# EAGLE design working (EAGLE 9.6.2)
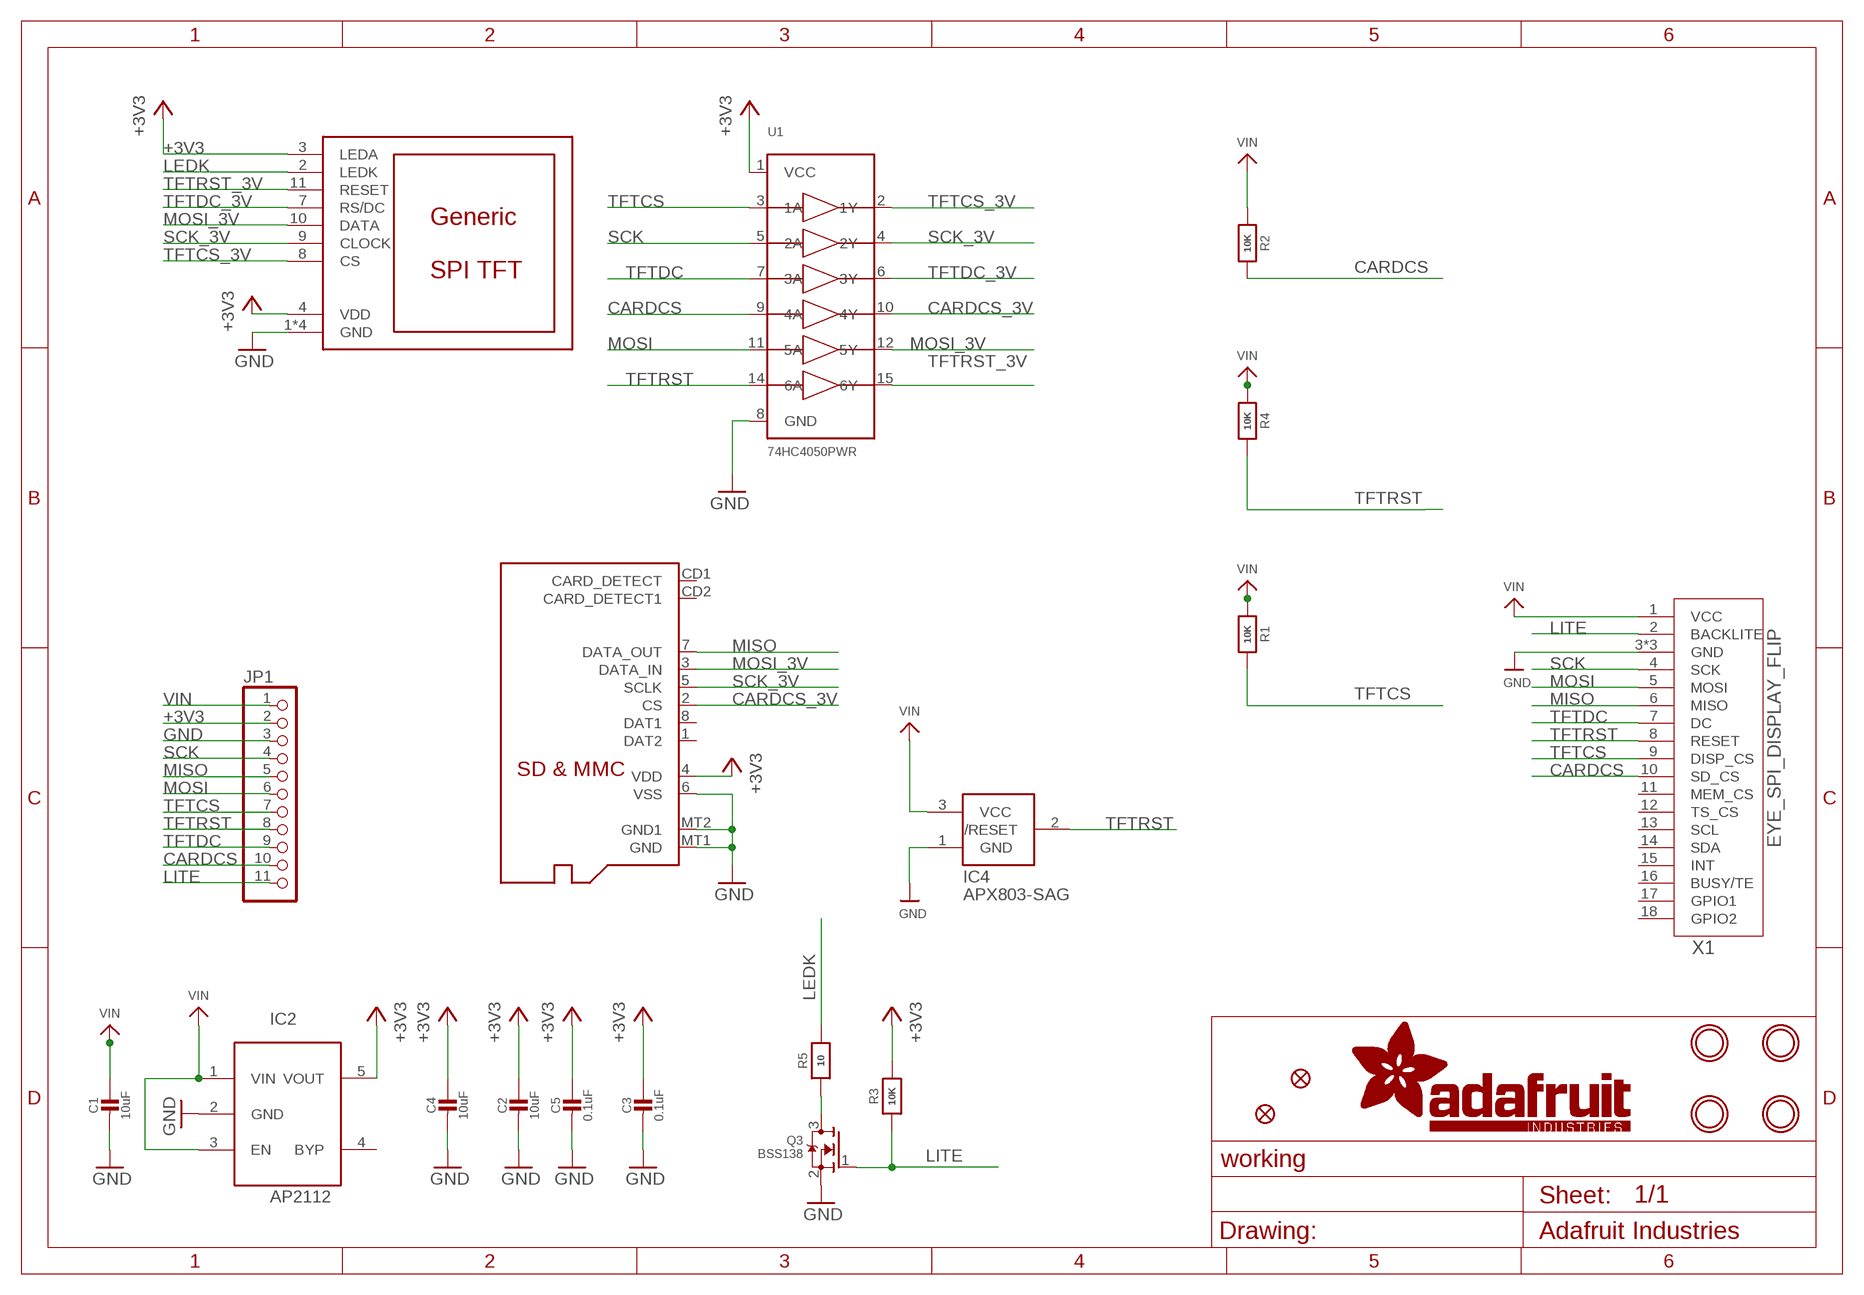
[diagram p0: schematic, sheet 1]

## Parts
C1  10uF  CAP_CERAMIC0805-NOOUTLINE  [0805-NO]
C2  10uF  CAP_CERAMIC0805-NOOUTLINE  [0805-NO]
C3  0.1uF  CAP_CERAMIC0603_NO  [0603-NO]
C4  10uF  CAP_CERAMIC0805-NOOUTLINE  [0805-NO]
C5  0.1uF  CAP_CERAMIC0603_NO  [0603-NO]
DISP1  DISP_LCD_GENERIC_SPI_1.47IN_172X320_12P_WRAPUNDER  [TFT_1.47IN_172X320_12P]
IC2  AP2112  LP298XS  [SOT23-5L]
IC4  APX803-SAG  AXP083-SAG  [SOT23]
JP1  HEADER-1X1176MIL  [1X11_ROUND_76]
Q2  MICROSD  [MICROSD]
Q3  BSS138  MOSFET-NWIDE  [SOT23-WIDE]
R1  10K  RESISTOR_0603_NOOUT  [0603-NO]
R2  10K  RESISTOR_0603_NOOUT  [0603-NO]
R3  10K  RESISTOR_0603_NOOUT  [0603-NO]
R4  10K  RESISTOR_0603_NOOUT  [0603-NO]
R5  10  RESISTOR_0603_NOOUT  [0603-NO]
U1  74HC4050PWR  74HC4050DTSSOP  [TSSOP16]
U$4  FIDUCIAL_1MM  [FIDUCIAL_1MM]
U$5  FIDUCIAL_1MM  [FIDUCIAL_1MM]
U$7  MOUNTINGHOLE2.5  [MOUNTINGHOLE_2.5_PLATED]
U$8  MOUNTINGHOLE2.5  [MOUNTINGHOLE_2.5_PLATED]
U$9  MOUNTINGHOLE2.5  [MOUNTINGHOLE_2.5_PLATED]
U$10  MOUNTINGHOLE2.5  [MOUNTINGHOLE_2.5_PLATED]
X1  EYE_SPI_DISPLAY_FLIP  [EYE_SPI_DISPLAY_BOTCONTACT]

## Nets
+3V3 [power]: C2.1 C3.1 C4.1 C5.1 DISP1.3(LEDA) DISP1.4(VDD) IC2.5(VOUT) JP1.2 Q2.4(VDD) R3.2 U1.1(VCC)
CARDCS: JP1.10 R2.1 U1.9(4A) X1.10(SD_CS)
CARDCS_3V: Q2.2(CS) U1.10(4Y)
GND: C1.2 C2.2 C3.2 C4.2 C5.2 DISP1.1(GND) DISP1.5(GND) DISP1.6(GND) DISP1.12(GND) IC2.2(GND) IC4.1(GND) JP1.3 Q2.6(VSS) Q2.MT1(GND) Q2.MT2(GND1) Q3.2(S) U1.8(GND) X1.3(GND) X1.SUPPORT1(GND) X1.SUPPORT2(GND)
LEDK: DISP1.2(LEDK) R5.2
LITE: JP1.11 Q3.1(G) R3.1 X1.2(BACKLITE)
MISO: JP1.5 Q2.7(DATA_OUT) X1.6(MISO)
MOSI: JP1.6 U1.11(5A) X1.5(MOSI)
MOSI_3V: DISP1.10(DATA) Q2.3(DATA_IN) U1.12(5Y)
N$1: Q3.3(D) R5.1
SCK: JP1.4 U1.5(2A) X1.4(SCK)
SCK_3V: DISP1.9(CLOCK) Q2.5(SCLK) U1.4(2Y)
TFTCS: JP1.7 R1.1 U1.3(1A) X1.9(DISP_CS)
TFTCS_3V: DISP1.8(CS) U1.2(1Y)
TFTDC: JP1.9 U1.7(3A) X1.7(DC)
TFTDC_3V: DISP1.7(RS/DC) U1.6(3Y)
TFTRST: IC4.2(/RESET) JP1.8 R4.1 U1.14(6A) X1.8(RESET)
TFTRST_3V: DISP1.11(RESET) U1.15(6Y)
VIN [power]: C1.1 IC2.1(VIN) IC2.3(EN) IC4.3(VCC) JP1.1 R1.2 R2.2 R4.2 X1.1(VCC)
Unconnected: IC2.4(BYP) Q2.1(DAT2) Q2.8(DAT1) Q2.CD1(CARD_DETECT) Q2.CD2(CARD_DETECT1) X1.11(MEM_CS) X1.12(TS_CS) X1.13(SCL) X1.14(SDA) X1.15(INT) X1.16(BUSY/TE) X1.17(GPIO1) X1.18(GPIO2)

## Library data of the parts
C1-C5 = microbuilder:CAP_CERAMIC: Ceramic Capacitors For new designs, use the packages preceded by an '_' character since they are more reliable: The following footprints should be used on most boards: _0402 - Standard footprint for regular board layouts _0603 - Standard footprint for regular board layouts _0805 - Standard footprint for regular board layouts _1206 - Standard footprint for regular board layouts For extremely tight-pitch boards where space is at a premium, the following 'micro-pitch' footprints can be used (smaller pads, no silkscreen outline, etc.): _0402MP - Micro-pitch footprint for very dense/compact boards _0603MP - Micro-pitch footprint for very dense/compact boards _0805MP - Micro-pitch footprint for very dense/compact boards _1206MP - Micro-pitch footprint for very dense/compact boards
DISP1 = adafruit_display:DISP_LCD_GENERIC_SPI
IC2 = adafruit:LP298X
IC4 = adafruit:AXP083
JP1 = microbuilder:HEADER-1X11
Q2 = adafruit:MICROSD: Micro-SD / Transflash card holder with SPI pinout For the 3M # 2908-05WB-MG and/or 4UCON #19656 push-push type
Q3 = microbuilder:MOSFET-N: N-Channel Mosfet LEGEND VDS: Voltage Drain-Source ID: Drain Current RDS(ON): Drain-Source On-State Resistance VGS(TH): Gate-Source Threshold Voltage CISS: Drain-Source Input Capacitance SOT-23 Name VDS ID RDS(ON) VGS(TH) CISS Order Number 2N7002E 60V 260mA 2.5 Ohm 2.5V @ 250uA 26.7pF @ 25V 2N7002ET1GOSTR-ND BSH103 30V 850mA 400 mOhm 400mV @ 1mA 83pF @ 24V BSH103,235-ND BSS138 60V 320mA 1.6 Ohm 1.5V @ 250uA 50pF @ 10V Mouser: 771-BSS138PW115 DMN2075U-7 20V 4.2A 38 mOhm 1V @ 250 uA 594.3pF @ 10V DMN2075U-7DICT-ND * BSS138 good choice for I2C level-shifting POWERPAK 1212-8 Name VDS ID RDS(ON) VGS(TH) CISS Order Number Si7308DN 60V 6A 58 mOhm 3V @ 250uA 665pF @ 15V SI7308DN-T1-E3CT-ND
R1-R5 = microbuilder:RESISTOR: Resistors For new designs, use the packages preceded by an '_' character since they are more reliable: The following footprints should be used on most boards: _0402 - Standard footprint for regular board layouts _0603 - Standard footprint for regular board layouts _0805 - Standard footprint for regular board layouts _1206 - Standard footprint for regular board layouts For extremely tight-pitch boards where space is at a premium, the following 'micro-pitch' footprints can be used (smaller pads, no silkscreen outline, etc.): _0402MP - Micro-pitch footprint for very dense/compact boards _0603MP - Micro-pitch footprint for very dense/compact boards _0805MP - Micro-pitch footprint for very dense/compact boards _1206MP - Micro-pitch footprint for very dense/compact boards
U1 = microbuilder:74HC4050D: 6-channel level shifter 74HC4050D - 2V-6V Supply SOIC16 Digikey: 74HC4050D,653-ND Mouser: 771-74HC4050D-T TSSOP16 Digikey: 296-9215-1-ND Mouser:
U$4 U$5 = microbuilder:FIDUCIAL: Fiducial Alignment Points Various fiducial points for machine vision alignment.; BOM: EXCLUDE
U$7-U$10 = microbuilder:MOUNTINGHOLE: Mounting Hole For #2 screws (0.086"/2.18mm width, 0.094"/2.4mm hole) use 2.5mm; BOM: EXCLUDE
X1 = adafruit_display:EYE_SPI_DISPLAY

## Net classes
1 power: width 0.254 mm

## Board
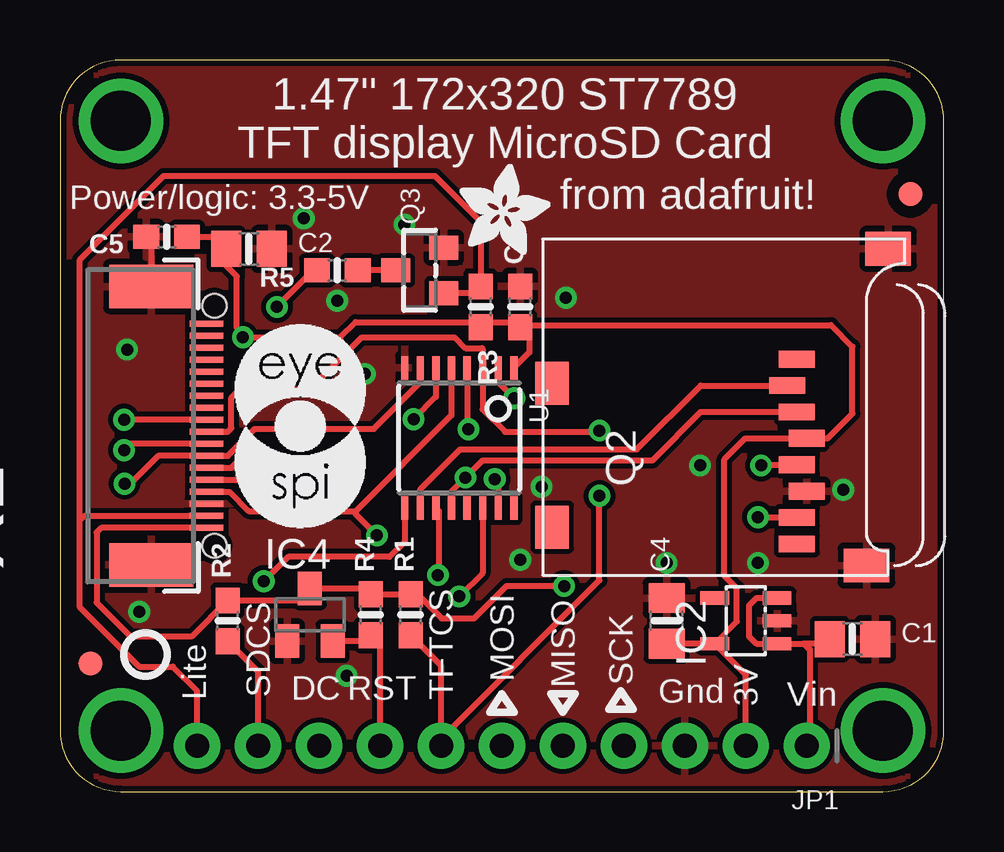
[diagram p1: board, top side]
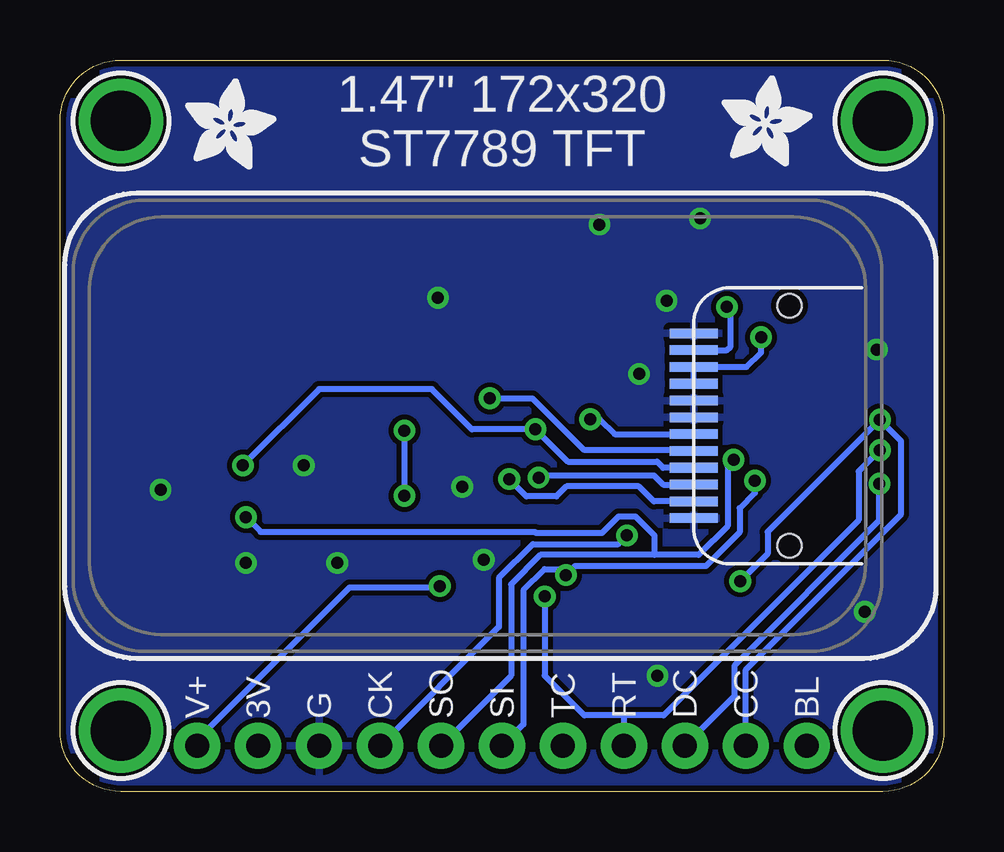
[diagram p2: board, bottom side, seen from below]

Size 36.83 x 30.48 mm. Coordinates in mm from the lower left corner, seen from the top.
Outline: 0,27.94 0,2.54 arc90 2.54,0 34.29,0 arc90 36.83,2.54 36.83,27.94 arc90 34.29,30.48 2.54,30.48 arc90 0,27.94
Copper layers (1*16): Top 0.035mm / dielectric 1.5mm / Bottom 0.035mm
Design rules "adafruit *": minimum track width 8mil, minimum drill 15.5mil, track to track 8mil, track to pad 8mil, pad to pad 8mil, via to via 8mil, smd to smd 8mil, copper to edge 10mil, drill to drill 8mil, minimum pad ring 10mil, minimum via ring 8mil, stop-mask expansion 2mil, vias tented up to drill 20mil, thermal gap 10mil

### Footprints (pad centres in the part's own frame; a part is rotated, then mirrored left to right if it is on the bottom)
0805-NO = smd 1.24 x 1.5: 1 -0.95,0; 2 0.95,0
0603-NO = smd 1.075 x 1: 1 -0.85,0; 2 0.85,0
TFT_1.47IN_172X320_12P = smd 0.4 x 2: 1 3.85,-9; 2 3.15,-9; 3 2.45,-9; 4 1.75,-9; 5 1.05,-9; 6 0.35,-9; 7 -0.35,-9; 8 -1.05,-9; 9 -1.75,-9; 10 -2.45,-9; 11 -3.15,-9; 12 -3.85,-9 | hole 1: -5,-13; 5,-13
SOT23-5L = smd 0.55 x 1.2: 1 -0.95,-1.3; 2 0,-1.3; 3 0.95,-1.3; 4 0.95,1.3; 5 -0.95,1.3
SOT23 = smd 1 x 1.4: 1 -0.95,-1.1; 2 0.95,-1.1; 3 0,1.1
1X11_ROUND_76 = drill 1 pad 1.93: 1 -12.7,0; 2 -10.16,0; 3 -7.62,0; 4 -5.08,0; 5 -2.54,0; 6 0,0; 7 2.54,0; 8 5.08,0; 9 7.62,0; 10 10.16,0; 11 12.7,0
MICROSD = smd 0.7 x 1.5: 1 9,-10.64; 2 7.9,-10.24; 3 6.8,-10.64; 4 5.7,-11.04; 5 4.6,-10.64; 6 3.5,-11.04; 7 2.4,-10.64; 8 1.3,-10.64 | smd 1.8 x 1.4: CD1 2,-0.44; CD2 8,-0.44 | smd 1.4 x 1.9: MT1 0.4,-13.54; MT2 13.6,-14.44
SOT23-WIDE = smd 1 x 1.2: 1 -0.95,-1; 2 0.95,-1; 3 0,1
TSSOP16 = smd 0.305 x 0.991: 1 -2.275,-2.918; 2 -1.625,-2.918; 3 -0.975,-2.918; 4 -0.325,-2.918; 5 0.325,-2.918; 6 0.975,-2.918; 7 1.625,-2.918; 8 2.275,-2.918; 9 2.275,2.918; 10 1.625,2.918; 11 0.975,2.918; 12 0.325,2.918; 13 -0.325,2.918; 14 -0.975,2.918; 15 -1.625,2.918; 16 -2.275,2.918
FIDUCIAL_1MM = smd 1 x 1: 1 0,0
MOUNTINGHOLE_2.5_PLATED = drill 2.5 pad 3.2: P$1 0,0
EYE_SPI_DISPLAY_BOTCONTACT = smd 0.25 x 1.4: 1 -4.25,-2.678; 2 -3.75,-2.678; 3 -3.25,-2.678; 4 -2.75,-2.678; 5 -2.25,-2.678; 6 -1.75,-2.678; 7 -1.25,-2.678; 8 -0.75,-2.678; 9 -0.25,-2.678; 10 0.25,-2.678; 11 0.75,-2.678; 12 1.25,-2.678; 13 1.75,-2.678; 14 2.25,-2.678; 15 2.75,-2.678; 16 3.25,-2.678; 17 3.75,-2.678; 18 4.25,-2.678 | smd 1.8 x 3.5: SUPPORT1 5.8,-0.372; SUPPORT2 -5.8,-0.372

### Placement (x,y rotation side)
C1  33.02,6.35 0 top
C2  7.87,22.61 0 top
C3  19.18,20.19 90 top
C4  25.27,7.11 90 top
C5  4.45,23.11 180 top
DISP1  19.43,15.24 90 bottom
IC2  28.57,7.11 90 top
IC4  10.41,7.37 0 top
JP1  18.41,1.91 180 top
Q2  20.07,9.02 90 top
Q3  14.99,21.72 90 top
R1  14.61,7.37 90 top
R2  6.99,7.11 90 top
R3  17.53,20.19 270 top
R4  12.95,7.37 90 top
R5  11.56,21.72 180 top
U1  16.64,14.73 180 top
U$1  [ADAFRUIT_3.5MM]  9.27,26.04 0 bottom
U$2  [PCBFEAT-REV-040]  3.56,5.71 180 top
U$4  35.43,24.89 270 top
U$5  1.27,5.33 0 top
U$7  34.29,27.94 270 bottom
U$8  2.54,27.94 270 bottom
U$9  34.29,2.54 270 bottom
U$10  2.54,2.54 270 bottom
U$20  [ADAFRUIT_3.5MM]  31.62,25.91 0 bottom
U$21  [ADAFRUIT_3.5MM]  16.64,22.35 0 top
U$22  [EYESPI_MINI_LOGO]  7.24,10.92 0 top
X1  3.43,15.24 90 top

### Tracks (layer width: path | path; a pad name or v marks a point on that pad's centre or on a via)
+3V3  (via drill 0.5)
  Top 0.254: C3.1 19.18,19.56 17.53,19.56 | U1.1 19.56,18.3 19.56,19.3 19.37,19.49 19.33,19.49 C3.1 | JP1.2 28.57,4.86 IC2.5 | 17.53,19.56 12.32,19.56 11.68,18.92 v7.62,18.92 7.62,19.05 7.37,19.3 7.37,21.46 6.51,22.32 6.9,22.71 6.74,22.86 6.6,22.86 | R3.2 17.53,19.56 | IC2.5 C4.1 | IC2.5 28.2,7.09 28.2,8.47 27.69,8.99 27.69,13.84 28.56,14.72 Q2.4 31.99,14.72 33.02,15.75 33.02,18.54 32.13,19.43 19.27,19.43 C3.1 | C5.1 6.35,23.11 6.6,22.86 | C2.1 6.86,22.61 6.6,22.86
  Bottom 0.254: DISP1.4 DISP1.3 8.22,17.69 7.62,18.29 v7.62,18.92
CARDCS  (via drill 0.5)
  Top 0.254: JP1.10 8.26,4.99 R2.1 | U1.9 14.36,10.42 13.72,9.78 9.5,9.78 v8.49,8.76 | X1.10 v2.67,15.49
  Bottom 0.254: JP1.10 8.26,5.08 1.78,11.56 1.78,14.61 v2.67,15.49 7.34,10.82 7.34,9.91 v8.49,8.76
CARDCS_3V
  Top 0.254: U1.10 15.01,12.6 16.67,14.26 24.04,14.26 26.7,16.92 Q2.2
GND  (via drill 0.5)
  Top 0.254: C5.2 3.8,22.91 X1.SUPPORT1
  other vias: 2.79,18.41 3.3,7.49 19.18,9.65 25.27,9.53 29.08,9.53 32.64,12.57 26.67,13.59 12.7,17.4 11.56,20.45 10.16,23.88 14.35,23.62 21.08,20.57 11.94,4.83 20.07,12.7
  pour Top: 0.13,30.48 36.83,30.48 36.83,0 0.13,0
  pour Bottom: 0.13,30.48 36.83,30.48 36.83,0 0.13,0
LEDK  (via drill 0.5)
  Top 0.254: v9.04,20.19 10.56,21.72 R5.2
  Bottom 0.254: DISP1.2 9.04,18.39 8.89,18.54 8.89,20.05 v9.04,20.19
LITE
  Top 0.254: JP1.11 5.71,4.19 4.7,5.21 3.3,5.21 0.83,7.68 0.83,11.3 | 0.83,11.3 0.83,22.16 4.32,25.65 15.62,25.65 17.53,23.75 R3.1 17.25,20.77 Q3.1 | 0.83,11.3 1.02,11.49 X1.2
MISO  (via drill 0.5)
  Top 0.254: v29.08,11.43 30.69,11.43 Q2.7 | X1.6 7.14,13.49 7.47,13.82 v8.76,13.82
  Bottom 0.254: JP1.5 18.03,4.83 18.03,8.64 16.82,9.86 12.06,9.86 | v8.76,13.82 9.02,13.57 9.02,11.06 10.22,9.86 12.06,9.86 | 12.06,9.86 12.06,10.67 12.85,11.45 13.57,11.45 14.25,10.77 16.99,10.77 17.04,10.82 28.47,10.82 v29.08,11.43
MOSI  (via drill 0.5)
  Top 0.254: U1.11 15.79,11.69 15.79,9.31 15.75,9.27 v15.75,9.02 | X1.5 7.84,12.99 v7.87,12.95
  Bottom 0.254: v7.87,12.95 7.87,12.45 8.51,11.81 8.51,10.79 9.91,9.4 15.37,9.4 v15.75,9.02 16,9.27 16.64,9.27 17.53,8.38 17.53,2.79 JP1.6
MOSI_3V  (via drill 0.5)
  Top 0.254: U1.12 16.31,12.5 v16.89,13.08 17.61,13.8 24.69,13.8 26.71,15.82 Q2.3
  Bottom 0.254: v16.89,13.08 16.8,13.17 12.08,13.17 11.7,12.79 DISP1.10
N$1
  Top 0.254: Q3.3 R5.1
SCK  (via drill 0.5)
  Top 0.254: U1.5 16.31,15.68 12.32,11.68 | 12.32,11.68 12.32,11.56 v13.21,10.67 | X1.4 7.07,12.49 7.87,11.68 12.32,11.68
  Bottom 0.254: v13.21,10.67 13.56,10.31 17.13,10.31 18.54,8.9 18.54,6.86 JP1.4
SCK_3V  (via drill 0.5)
  Top 0.254: U1.4 16.96,15.15 v17.02,15.09 | v29.21,13.59 29.24,13.62 Q2.5
  Bottom 0.254: DISP1.9 11.7,13.49 11.96,13.74 15.67,13.74 v17.02,15.09 19.66,15.09 21.34,16.76 26.04,16.76 v29.21,13.59
TFTCS  (via drill 0.5)
  Top 0.254: R1.1 15.88,5.25 15.88,2.2 | JP1.7 15.88,2.2 | 15.88,2.2 22.48,8.8 v22.48,12.32 | v22.48,15.04 22.42,14.99 18.54,14.99 17.61,15.92 U1.3 17.61,18.46 17.59,18.48 16.89,18.48 16.44,18.92 12.57,18.92 10.41,16.76 7.49,16.76 7.14,16.41 7.14,15.14 6.99,14.99 X1.9
  Bottom 0.254: v22.48,15.04 v22.48,12.32
TFTCS_3V  (via drill 0.5)
  Top 0.254: U1.2 18.26,17.04 v18.92,16.38
  Bottom 0.254: v18.92,16.38 17.14,16.38 14.99,14.22 10.46,14.22 DISP1.8
TFTDC  (via drill 0.5)
  Top 0.254: U1.7 15.01,17.04 13.08,15.11 8.12,15.11 6.99,13.99 X1.7 4.08,13.99 2.92,12.83 v2.69,12.83
  Bottom 0.254: JP1.9 8.71,3.99 8.71,5.27 2.69,11.29 v2.69,12.83
TFTDC_3V  (via drill 0.5)
  Top 0.254: U1.6 15.66,16.45 v14.73,15.52 | v14.73,15.52
  Bottom 0.254: v14.73,15.52 14.35,15.52 13.73,14.89 DISP1.7
TFTRST  (via drill 0.5)
  Top 0.254: JP1.8 13.34,6.13 R4.1 12.7,6.27 IC4.2 | U1.14 17.61,9.1 v16.64,8.13 | X1.8 2.93,14.49 v2.67,14.22
  Bottom 0.254: 13.34,3.17 JP1.8 | v2.67,14.22 3.56,13.34 3.56,11.3 11.68,3.17 13.34,3.17 | 13.34,3.17 14.99,3.17 16.64,4.83 v16.64,8.13
TFTRST_3V  (via drill 0.5)
  Top 0.254: v18.11,13.02 18.26,12.87 U1.15
  Bottom 0.254: DISP1.11 12.08,12.09 12.71,12.71 15.73,12.71 16.15,12.3 17.39,12.3 v18.11,13.02
VIN  (via drill 0.5)
  Top 0.254: IC2.3 29.02,8.06 28.7,7.75 28.7,6.48 29.02,6.16 IC2.1 30.99,6.16 | JP1.1 31.24,2.03 31.24,5.91 30.99,6.16 | v21,8.56 18.6,8.56 17.25,7.22 15.9,7.22 14.9,8.22 R1.2 R4.2 12.7,8.47 IC4.3 9.91,7.96 R2.2 5.5,6.48 2.92,6.48 1.52,7.87 1.52,10.79 1.72,10.99 X1.1 | C1.1 31.88,6.16 30.99,6.16
  Bottom 0.254: JP1.1 31.24,2.03 24.77,8.51 21.06,8.51 v21,8.56

### Text on the board
tPlace: 1.47" 172x320 ST7789 / TFT display MicroSD Card | Power/logic: 3.3-5V | from adafruit! | DC | RST | MOSI | Gnd | Vin | Lite | SDCS | TFTCS | MISO | SCK | 3V
bPlace: 1.47" 172x320 / ST7789 TFT | BL | CC | DC | RT | TC | SI | SO | CK | G | 3V | V+